# EAGLE board Arche-RoboCore (EAGLE 9.6.2), part 1 of 2
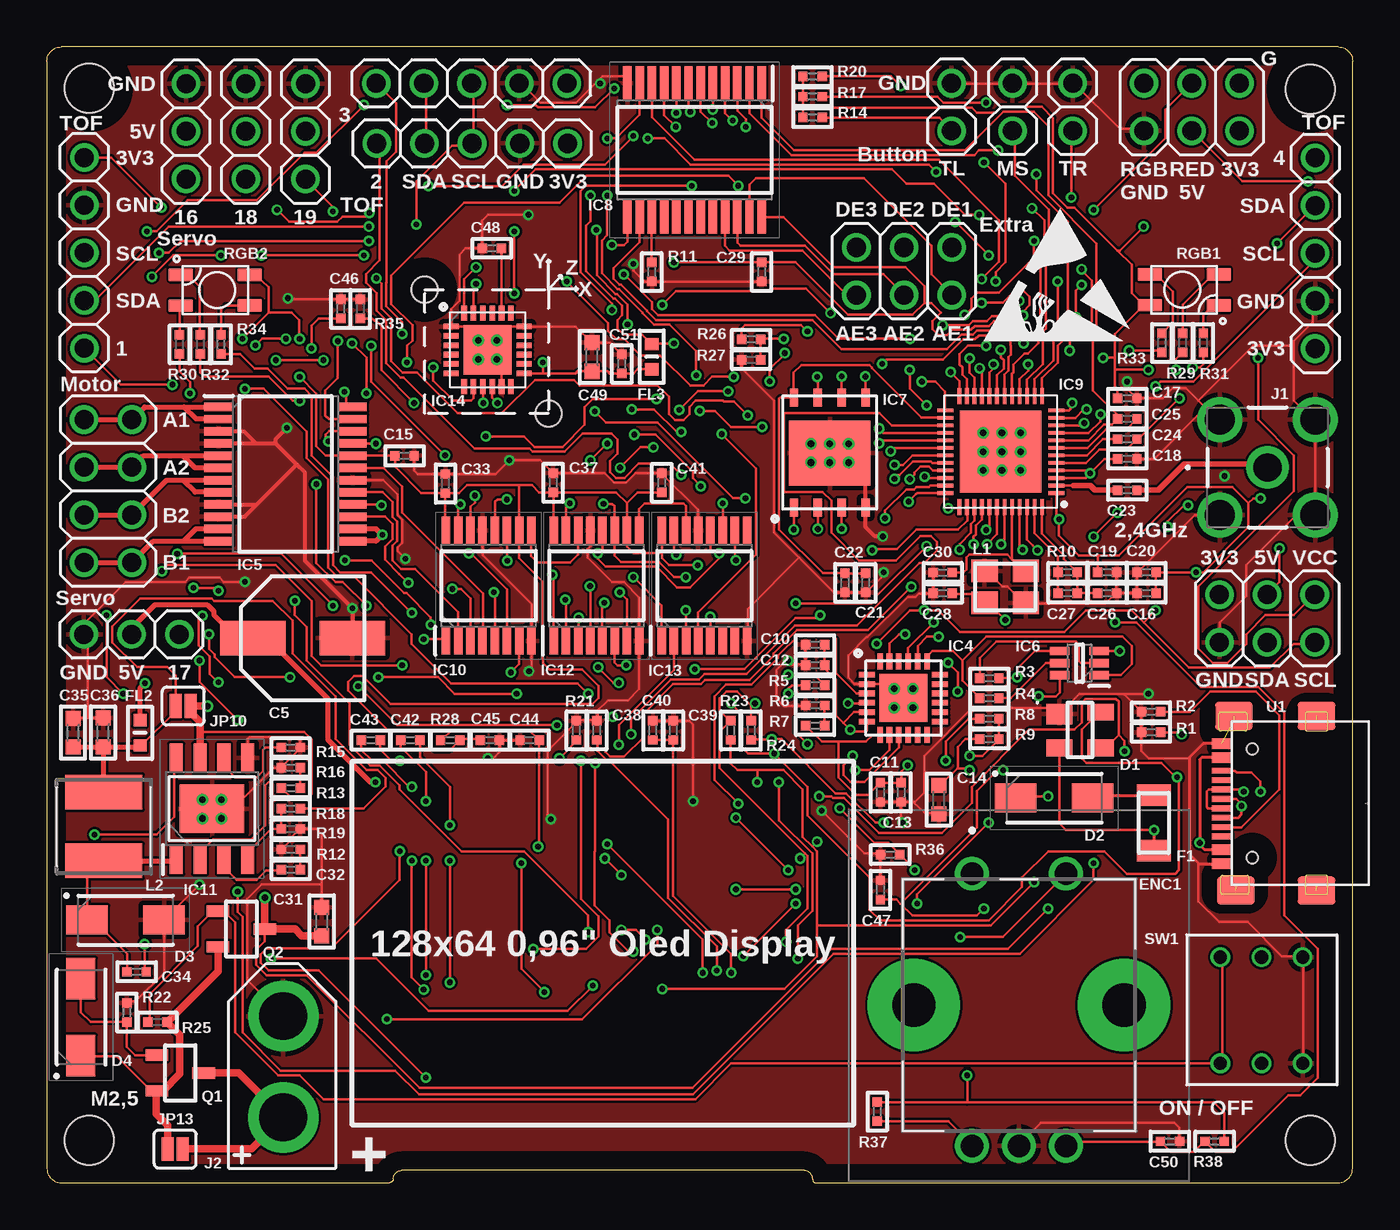
[diagram p2: board, top side]
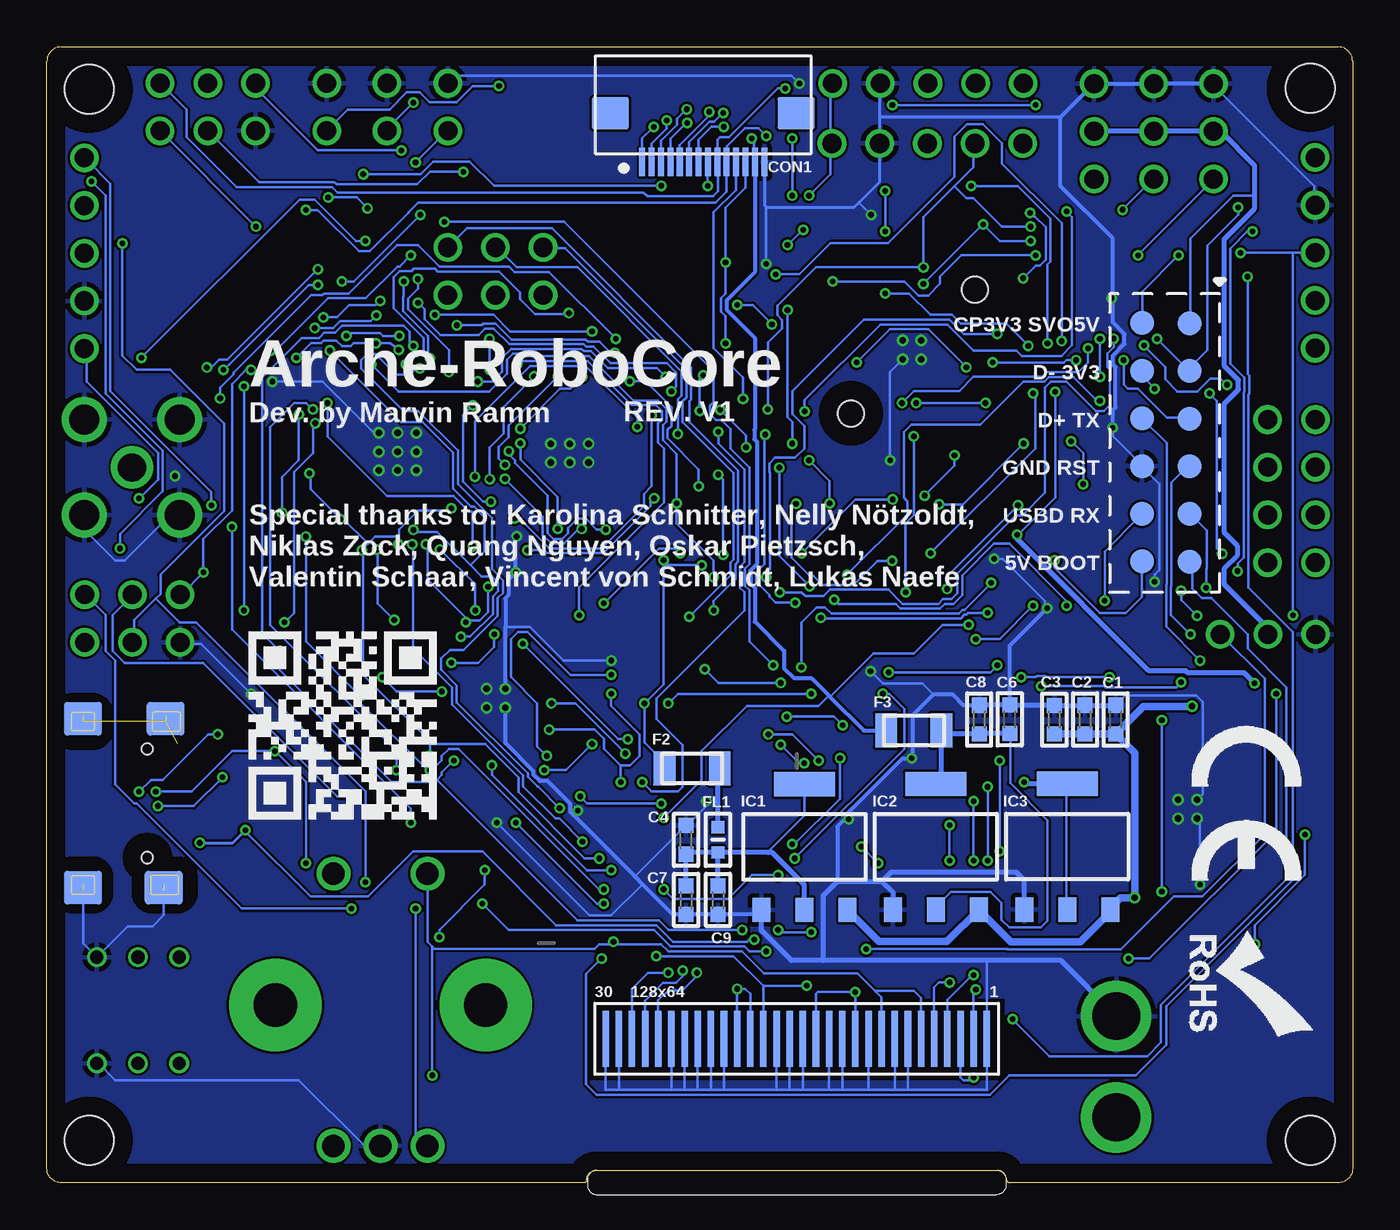
[diagram p3: board, bottom side, seen from below]

Size 69.55 x 60.5 mm. Coordinates in mm from the lower left corner, seen from the top.
Outline: 0.75,0 18.25,0 arc90 18.45,0.2 arc-90 18.9,0.65 40.3,0.65 arc-90 40.8,0.15 arc90 40.9,0 68.8,0 arc90 69.55,0.75 69.55,59.75 arc90 68.8,60.5 0.75,60.5 arc90 0,59.75 0,0.75 arc90 0.75,0
Copper layers (1*16): Top 0.035mm / dielectric 1.53mm / Bottom 0.035mm
Design rules "JLCPCB_1-2layer": minimum track width 5mil, minimum drill 0.3mm, track to track 5mil, track to pad 0.2mm, pad to pad 7mil, via to via 7mil, smd to smd 7mil, copper to edge 40mil, drill to drill 6mil, minimum pad ring 6mil, minimum via ring 0.13mm, stop-mask expansion 0.1mm, vias tented up to drill 20mil, thermal gap 10mil
Holes 2.6 mm at 2.25,2.25 2.25,58.3 67.3,58.25 67.3,2.25
Holes 1.4 mm at 26.72,40.97 20.12,47.57
tRestrict: area 48,36.4 to 53.5,41.6; area 22,42.8 to 25,45.9; area 44.1,24.2 to 47.1,27.2; area 8.9,39.4 to 9.4,40; area 8.9,35.5 to 9.3,36.1
bRestrict: area 18.6,5.4 to 40.6,9.8

## Footprints (pad centres in the part's own frame; a part is rotated, then mirrored left to right if it is on the bottom)
C0603 = smd 0.8 x 0.8: 1 -0.762,0; 2 0.762,0
CAPAE660X800N = smd 3.5 x 1.85: 1 -2.65,0; 2 2.65,0
C0402 = smd 0.5 x 0.5: 1 -0.508,0; 2 0.508,0
FC05-S14FCT-00 = smd 0.32 x 1.5: 1 2.51,-0.45; 2 3.01,-0.45; 3 3.51,-0.45; 4 4.01,-0.45; 5 4.51,-0.45; 6 5.01,-0.45; 7 5.51,-0.45; 8 6.01,-0.45; 9 6.51,-0.45; 10 7.01,-0.45; 11 7.51,-0.45; 12 8.01,-0.45; 13 8.51,-0.45; 14 9.01,-0.45 | smd 2 x 1.7: PAD1 0.81,2.15; PAD2 10.71,2.15
SP0503BAHTG = smd 1.1 x 1.4: 1 -0.85,-1.1 | smd 0.9 x 1.4: 2 0.95,-1.1; 3 0.95,1.1; 4 -0.95,1.1
DIOM5026X262N = smd 2.2 x 1.55: 1 -2.05,0; 2 2.05,0
2864KSWE_128X64I2C = smd 0.35 x 3: D1 0.175,1.5; D2 0.875,1.5; D3 1.575,1.5; D4 2.275,1.5; D5 2.975,1.5; D6 3.675,1.5; D7 4.375,1.5; D8 5.075,1.5; D9 5.775,1.5; D10 6.475,1.5; D11 7.175,1.5; D12 7.875,1.5; D13 8.575,1.5; D14 9.275,1.5; D15 9.975,1.5; D16 10.675,1.5; D17 11.375,1.5; D18 12.075,1.5; D19 12.775,1.5; D20 13.475,1.5; D21 14.175,1.5; D22 14.875,1.5; D23 15.575,1.5; D24 16.275,1.5; D25 16.975,1.5; D26 17.675,1.5; D27 18.375,1.5; D28 19.075,1.5; D29 19.775,1.5; D30 20.475,1.5
PEC12R4230FS0024 = drill 1.2 pad 1.8: 1 0,0; 2 5,0; A1 0,-14.5; B1 5,-14.5; C1 2.5,-14.5 | drill 2.3 pad 4.92: MH1 -3.1,-7; MH2 8.1,-7
FUSC3216X82N = smd 1.16 x 1.81: 1 -1.475,0; 2 1.475,0
BLM18AG102BH1D = smd 0.65 x 0.7: 1 -0.675,0; 2 0.675,0
SOT229P700X180-4N = smd 1.3 x 0.95: 1 -3.35,2.29; 2 -3.35,0; 3 -3.35,-2.29 | smd 1.3 x 3.25: 4 3.35,0
QFN50P400X400X80-25N = smd 0.85 x 0.3: 1 -1.95,1.25; 2 -1.95,0.75; 3 -1.95,0.25; 4 -1.95,-0.25; 5 -1.95,-0.75; 6 -1.95,-1.25; 13 1.95,-1.25; 14 1.95,-0.75; 15 1.95,-0.25; 16 1.95,0.25; 17 1.95,0.75; 18 1.95,1.25 | smd 0.3 x 0.85: 7 -1.25,-1.95; 8 -0.75,-1.95; 9 -0.25,-1.95; 10 0.25,-1.95; 11 0.75,-1.95; 12 1.25,-1.95; 19 1.25,1.95; 20 0.75,1.95; 21 0.25,1.95; 22 -0.25,1.95; 23 -0.75,1.95; 24 -1.25,1.95 | smd 2.55 x 2.55: 25 0,0
SOP65P760X160-24N = smd 1.525 x 0.45: 1 -3.562,3.575; 2 -3.562,2.925; 3 -3.562,2.275; 4 -3.562,1.625; 5 -3.562,0.975; 6 -3.562,0.325; 7 -3.562,-0.325; 8 -3.562,-0.975; 9 -3.562,-1.625; 10 -3.562,-2.275; 11 -3.562,-2.925; 12 -3.562,-3.575; 13 3.562,-3.575; 14 3.562,-2.925; 15 3.562,-2.275; 16 3.562,-1.625; 17 3.562,-0.975; 18 3.562,-0.325; 19 3.562,0.325; 20 3.562,0.975; 21 3.562,1.625; 22 3.562,2.275; 23 3.562,2.925; 24 3.562,3.575
SOT65P230X120-6N = smd 1.05 x 0.45: 1 -1.05,0.65; 2 -1.05,0; 3 -1.05,-0.65; 4 1.05,-0.65; 5 1.05,0; 6 1.05,0.65
SON127P800X600X80-9N = smd 0.95 x 0.45: 1 -2.85,1.905; 2 -2.85,0.635; 3 -2.85,-0.635; 4 -2.85,-1.905; 5 3,-1.905; 6 3,-0.635; 7 3,0.635; 8 3,1.905 | smd 3.45 x 4.35: 9 0.05,0
SOP65P780X200-24N = smd 1.8 x 0.45: 1 -3.55,3.575; 2 -3.55,2.925; 3 -3.55,2.275; 4 -3.55,1.625; 5 -3.55,0.975; 6 -3.55,0.325; 7 -3.55,-0.325; 8 -3.55,-0.975; 9 -3.55,-1.625; 10 -3.55,-2.275; 11 -3.55,-2.925; 12 -3.55,-3.575; 13 3.55,-3.575; 14 3.55,-2.925; 15 3.55,-2.275; 16 3.55,-1.625; 17 3.55,-0.975; 18 3.55,-0.325; 19 3.55,0.325; 20 3.55,0.975; 21 3.55,1.625; 22 3.55,2.275; 23 3.55,2.925; 24 3.55,3.575
QFN40P600X600X90-49N = smd 0.85 x 0.2: 1 -2.95,2.2; 2 -2.95,1.8; 3 -2.95,1.4; 4 -2.95,1; 5 -2.95,0.6; 6 -2.95,0.2; 7 -2.95,-0.2; 8 -2.95,-0.6; 9 -2.95,-1; 10 -2.95,-1.4; 11 -2.95,-1.8; 12 -2.95,-2.2; 25 2.95,-2.2; 26 2.95,-1.8; 27 2.95,-1.4; 28 2.95,-1; 29 2.95,-0.6; 30 2.95,-0.2; 31 2.95,0.2; 32 2.95,0.6; 33 2.95,1; 34 2.95,1.4; 35 2.95,1.8; 36 2.95,2.2 | smd 0.2 x 0.85: 13 -2.2,-2.95; 14 -1.8,-2.95; 15 -1.4,-2.95; 16 -1,-2.95; 17 -0.6,-2.95; 18 -0.2,-2.95; 19 0.2,-2.95; 20 0.6,-2.95; 21 1,-2.95; 22 1.4,-2.95; 23 1.8,-2.95; 24 2.2,-2.95; 37 2.2,2.95; 38 1.8,2.95; 39 1.4,2.95; 40 1,2.95; 41 0.6,2.95; 42 0.2,2.95; 43 -0.2,2.95; 44 -0.6,2.95; 45 -1,2.95; 46 -1.4,2.95; 47 -1.8,2.95; 48 -2.2,2.95 | smd 4.35 x 4.35: 49 0,0
SOP65P640X110-16N = smd 1.475 x 0.45: 1 -2.938,2.275; 2 -2.938,1.625; 3 -2.938,0.975; 4 -2.938,0.325; 5 -2.938,-0.325; 6 -2.938,-0.975; 7 -2.938,-1.625; 8 -2.938,-2.275; 9 2.938,-2.275; 10 2.938,-1.625; 11 2.938,-0.975; 12 2.938,-0.325; 13 2.938,0.325; 14 2.938,0.975; 15 2.938,1.625; 16 2.938,2.275
SOIC127P600X170-9N = smd 1.525 x 0.7: 1 -2.712,1.905; 2 -2.712,0.635; 3 -2.712,-0.635; 4 -2.712,-1.905; 5 2.712,-1.905; 6 2.712,-0.635; 7 2.712,0.635; 8 2.712,1.905 | smd 2.56 x 3.45: 9 0,0
QFN50P400X400X95-25N = smd 0.8 x 0.3: 1 -1.95,1.25; 2 -1.95,0.75; 3 -1.95,0.25; 4 -1.95,-0.25; 5 -1.95,-0.75; 6 -1.95,-1.25; 13 1.95,-1.25; 14 1.95,-0.75; 15 1.95,-0.25; 16 1.95,0.25; 17 1.95,0.75; 18 1.95,1.25 | smd 0.3 x 0.8: 7 -1.25,-1.95; 8 -0.75,-1.95; 9 -0.25,-1.95; 10 0.25,-1.95; 11 0.75,-1.95; 12 1.25,-1.95; 19 1.25,1.95; 20 0.75,1.95; 21 0.25,1.95; 22 -0.25,1.95; 23 -0.75,1.95; 24 -1.25,1.95 | smd 2.55 x 2.65: 25 0,0
518148322 = drill 1.5 pad 2.25: 1 0,0 | drill 1.6 pad 2.4: 2 -2.54,-2.54; 3 2.54,-2.54; 4 2.54,2.54; 5 -2.54,2.54
XT_30 = drill 2.55 pad 3.75: B+ 0,0; GND 5.4,0
2X04 = drill 1.016: 1 -3.81,-1.27; 2 -3.81,1.27; 3 -1.27,-1.27; 4 -1.27,1.27; 5 1.27,-1.27; 6 1.27,1.27; 7 3.81,-1.27; 8 3.81,1.27
1X05 = drill 1.016: 1 -5.08,0; 2 -2.54,0; 3 0,0; 4 2.54,0; 5 5.08,0
1X02 = drill 1.016: 1 -1.27,0; 2 1.27,0
2X03 = drill 1.016: 1 -2.54,-1.27; 2 -2.54,1.27; 3 0,-1.27; 4 0,1.27; 5 2.54,-1.27; 6 2.54,1.27
SMT-JUMPER_2_NO_SILK = smd 0.635 x 1.27: 1 -0.406,0; 2 0.406,0
1X03 = drill 1.016: 1 -2.54,0; 2 0,0; 3 2.54,0
SMD3225_4P16MHZ20PF10PPM4085 = smd 1.4 x 1.2: 1 -1.1,-0.85; 2 1.1,-0.85; 3 1.1,0.85; 4 -1.1,0.85
LQH5BPB100MT0L = smd 1.85 x 4.1: 1 -1.825,0; 2 1.825,0
SOT95P280X125-3N = smd 1.2 x 0.6: 1 -1.25,0.95; 2 -1.25,-0.95; 3 1.25,0
R0402 = smd 0.5 x 0.5: 1 -0.508,0; 2 0.508,0
RGBLED = smd 0.686 x 1.3: +5V -1.456,1.996; P1 0.184,1.996; P2 -1.458,-1.678; P3 0.192,-1.678
XKB7070-Z = drill 0.7: 1_1 1.8,1.15; 1_2 6.18,1.15; 2_1 1.8,6.8; 2_2 6.18,6.8; NC 3.99,1.15; NC2 3.99,6.8
PAD.03X.05 = smd 1.27 x 1.27: 1 0,0
TYPE-C-31-M-14_HRO = smd 0.559 x 1.092: A1B12 -3.11,4; A4B9 -2.36,4; B1A12 3.29,4; B4A9 2.54,4 | smd 0.305 x 1.092: A5 -1.16,4; A6 -0.16,4; A7 0.34,4; A8 1.34,4; B5 1.84,4; B6 0.84,4; B7 -0.66,4; B8 -1.66,4 | smd 1.5 x 2 bottom: P$1 -4.24,3.26; P$2 4.46,3.36; P$3 -4.44,3.26; P$4 4.66,3.36; P$5 -4.24,-1.04; P$6 -4.44,-1.04; P$7 4.46,-1.04; P$8 4.66,-1.04; P$9 -4.54,3.26; P$10 -4.54,-1.04; P$11 4.76,-1.04; P$12 4.76,3.36 | smd 1.5 x 2: P$14 -4.54,3.26; P$16 -4.54,-1.04; P$18 4.76,3.36; P$20 4.76,-1.04 | hole 0.6: -2.79,2.39; 3.01,2.39

## Placement (x,y rotation side)
C1  4,7µF  [C0603]  12.62,24.67 90 bottom
C2  4,7µF  [C0603]  14.25,24.67 90 bottom
C3  4,7µF  [C0603]  15.89,24.66 90 bottom
C4  10µF  [C0603]  35.51,18.26 90 bottom
C5  UUD1C151MCL1GS  [CAPAE660X800N]  13.62,29 0 top
C6  10µF  [C0603]  18.26,24.68 90 bottom
C7  10µF  [C0603]  35.5,15.05 270 bottom
C8  10µF  [C0603]  19.89,24.67 90 bottom
C9  10µF  [C0603]  33.8,15.05 270 bottom
C10  0,1uF  [C0402]  40.92,28.66 0 top
C11  0,1uF  [C0402]  44.4,20.79 90 top
C12  4,7uF  [C0402]  40.92,27.57 0 top
C13  4,7uF  [C0402]  45.5,20.79 90 top
C14  10µF  [C0603]  47.51,20.4 90 top
C15  100nF  [C0402]  19.05,38.72 0 top
C16  100pF  [C0402]  58.57,31.4 0 top
C17  0,1uF  [C0402]  57.55,41.78 180 top
C18  0,1uF  [C0402]  57.55,38.55 180 top
C19  0,1uF  [C0402]  56.48,32.51 180 top
C20  0,1uF  [C0402]  58.57,32.51 0 top
C21  1uF  [C0402]  43.62,31.95 90 top
C22  0,1uF  [C0402]  42.51,31.95 90 top
C23  5,6pF  [C0402]  57.55,36.89 0 top
C24  270pF  [C0402]  57.55,39.61 180 top
C25  270pF  [C0402]  57.55,40.69 0 top
C26  10nF  [C0402]  56.48,31.4 180 top
C27  3nF  [C0402]  54.37,31.4 180 top
C28  12pF  [C0402]  47.72,31.39 0 top
C29  0,1µF  [C0402]  38.07,48.51 270 top
C30  12pF  [C0402]  47.72,32.5 0 top
C31  10µF  [C0603]  14.64,13.91 270 top
C32  100pF  [C0402]  12.99,16.67 180 top
C33  0,1µF  [C0402]  21.23,37.24 90 top
C34  0,1µF  [C0402]  4.78,11.23 180 top
C35  10µF  [C0603]  1.39,23.97 270 top
C36  10µF  [C0603]  2.99,23.98 270 top
C37  0,1µF  [C0402]  26.97,37.28 90 top
C38  1µF  [C0402]  29.3,24.09 270 top
C39  1µF  [C0402]  33.37,24.09 270 top
C40  1µF  [C0402]  32.28,24.09 270 top
C41  0,1µF  [C0402]  32.75,37.28 90 top
C42  1µF  [C0402]  19.36,23.57 0 top
C43  1µF  [C0402]  17.25,23.57 0 top
C44  1µF  [C0402]  25.71,23.57 180 top
C45  1µF  [C0402]  23.6,23.57 0 top
C46  100nF  [C0402]  15.65,46.54 270 top
C47  10nF  [C0402]  44.4,15.59 90 top
C48  10nF  [C0402]  23.7,49.77 180 top
C49  10µF  [C0603]  29.03,43.98 270 top
C50  10nF  [C0402]  59.82,2.2 0 top
C51  1uF  [C0402]  30.62,43.61 90 top
CON1  FC05-S14FCT-00  [FC05-S14FCT-00]  40.35,54.82 0 bottom
D1  SP0503BAHTG  [SP0503BAHTG]  55.03,24.11 270 top
D2  SS34A  [DIOM5026X262N]  53.66,20.49 0 top
D3  SS34A  [DIOM5026X262N]  4.19,13.99 0 top
D4  SS34A  [DIOM5026X262N]  1.81,8.82 90 top
DSP1  2864KSWE_128X64I2C  [2864KSWE_128X64I2C]  39.96,6.16 0 bottom
ENC1  PEC12R-4230F-S0024  [PEC12R4230FS0024]  49.28,16.46 0 top
F1  NANOSMDC020F-2  [FUSC3216X82N]  58.96,19.16 90 top
F2  NANOSMDC020F-2  [FUSC3216X82N]  35.18,22.07 0 bottom
F3  NANOSMDC020F-2  [FUSC3216X82N]  23.37,24.09 0 bottom
FL1  BLM18PG121SN1D  [BLM18AG102BH1D]  33.81,18.26 270 bottom
FL2  BLM18PG121SN1D  [BLM18AG102BH1D]  4.96,23.96 270 top
FL3  BLM18PG121SN1D  [BLM18AG102BH1D]  32.22,44 270 top
IC1  AMS1117-3.3  [SOT229P700X180-4N]  29.2,17.88 90 bottom
IC2  AMS1117-3.3  [SOT229P700X180-4N]  22.2,17.89 90 bottom
IC3  AMS1117-3.3  [SOT229P700X180-4N]  15.2,17.9 90 bottom
IC4  CP2102N-A02-GQFN24R  [QFN50P400X400X80-25N]  45.63,25.81 0 top
IC5  TB6612FNG,C,8,EL  [SOP65P760X160-24N]  12.71,37.75 0 top
IC6  MMDT3904-TP  [SOT65P230X120-6N]  55,27.67 180 top
IC7  W25Q128JVPIQ  [SON127P800X600X80-9N]  41.7,38.82 90 top
IC8  CD74HC4067SM96  [SOP65P780X200-24N]  34.5,55.01 270 top
IC9  ESP32-D0WDQ6  [QFN40P600X600X90-49N]  50.81,38.94 180 top
IC10  74HC595PW,118  [SOP65P640X110-16N]  23.53,31.8 90 top
IC11  MP1584EN-LF-Z  [SOIC127P600X170-9N]  8.79,19.92 90 top
IC12  74HC595PW,118  [SOP65P640X110-16N]  29.27,31.8 90 top
IC13  74HC595PW,118  [SOP65P640X110-16N]  35.02,31.8 90 top
IC14  MPU-6050  [QFN50P400X400X95-25N]  23.47,44.36 0 top
J1  5-1814832-2  [518148322]  65.02,38.1 0 top
J2  XT_30  [XT_30]  12.59,3.47 90 top
JP1  [2X04]  3.25,36.84 270 top
JP2  [1X05]  1.99,49.53 270 top
JP3  [1X02]  48.19,57.3 270 top
JP4  [2X03]  60.98,57.3 0 top
JP5  [1X05]  22.65,55.36 180 top
JP6  [1X02]  51.44,57.3 270 top
JP7  [1X05]  22.62,58.56 180 top
JP8  [1X02]  54.64,57.3 270 top
JP9  [1X05]  67.56,49.51 90 top
JP10  JUMPER-SMT_2_NO_SILK  [SMT-JUMPER_2_NO_SILK]  7.26,25.39 0 top
JP11  [1X03]  10.59,56 90 top
JP12  [1X03]  13.77,56 90 top
JP13  JUMPER-SMT_2_NO_SILK  [SMT-JUMPER_2_NO_SILK]  6.83,1.79 0 top
JP14  [1X03]  4.51,29.21 180 top
JP15  [1X03]  7.41,56 90 top
JP16  [2X03]  45.66,48.55 180 top
JP17  [2X03]  65,30.05 180 top
L1  SMD-3225_4P16MHZ_20PF_10PPM_-4  [SMD3225_4P16MHZ20PF10PPM4085]  51.05,31.74 0 top
L2  LQH5BPB100MT0L  [LQH5BPB100MT0L]  3.03,18.97 90 top
Q1  AO3407A  [SOT95P280X125-3N]  7.1,5.84 0 top
Q2  AO3407A  [SOT95P280X125-3N]  10.36,13.51 0 top
R1  5,1kΩ  [R0402]  58.81,23.99 180 top
R2  5,1kΩ  [R0402]  58.81,25.08 180 top
R3  10kΩ  [R0402]  50.2,26.88 0 top
R4  10kΩ  [R0402]  50.2,25.8 0 top
R5  2,2kΩ  [R0402]  40.92,26.49 0 top
R6  33kΩ  [R0402]  40.92,25.42 180 top
R7  22kΩ  [R0402]  40.92,24.35 0 top
R8  10kΩ  [R0402]  50.2,24.71 180 top
R9  10kΩ  [R0402]  50.2,23.63 0 top
R10  20kΩ  [R0402]  54.37,32.51 0 top
R11  10kΩ  [R0402]  32.22,48.51 270 top
R12  100kΩ  [R0402]  12.99,17.75 180 top
R13  100kΩ  [R0402]  12.99,21.02 180 top
R14  N/C  [R0402]  40.78,56.74 180 top
R15  100kΩ  [R0402]  12.99,23.18 0 top
R16  100kΩ  [R0402]  12.99,22.11 0 top
R17  10kΩ  [R0402]  40.78,57.85 180 top
R18  75kΩ  [R0402]  12.99,19.93 0 top
R19  10kΩ  [R0402]  12.99,18.84 180 top
R20  10kΩ  [R0402]  40.78,58.92 180 top
R21  390kΩ  [R0402]  28.2,24.09 90 top
R22  100kΩ  [R0402]  4.26,9.06 270 top
R23  10kΩ  [R0402]  36.42,24.09 90 top
R24  10kΩ  [R0402]  37.51,24.09 90 top
R25  100kΩ  [R0402]  5.89,8.55 180 top
R26  100kΩ  [R0402]  37.51,44.92 0 top
R27  64,9kΩ  [R0402]  37.51,43.84 180 top
R28  10kΩ  [R0402]  21.48,23.57 0 top
R29  2,2kΩ  [R0402]  60.5,44.73 270 top
R30  2,2kΩ  [R0402]  7.06,44.66 270 top
R31  2,2kΩ  [R0402]  61.6,44.73 270 top
R32  2,2kΩ  [R0402]  8.17,44.66 270 top
R33  2,2kΩ  [R0402]  59.39,44.73 270 top
R34  2,2kΩ  [R0402]  9.28,44.66 270 top
R35  10kΩ  [R0402]  16.69,46.54 270 top
R36  10kΩ  [R0402]  44.92,17.48 0 top
R37  10kΩ  [R0402]  44.23,3.79 270 top
R38  10kΩ  [R0402]  62.2,2.2 180 top
RGB1  RGBLED  [RGBLED]  60.74,48.2 90 top
RGB2  RGBLED  [RGBLED]  8.81,46.91 270 top
SW1  XKB7070-Z  [XKB7070-Z]  60.71,5.21 0 top
TP1  TEST-POINT3X5  [PAD.03X.05]  11.22,33.09 270 bottom
TP3  TEST-POINT3X5  [PAD.03X.05]  11.22,35.63 270 bottom
TP4  TEST-POINT3X5  [PAD.03X.05]  11.22,38.17 270 bottom
TP5  TEST-POINT3X5  [PAD.03X.05]  11.22,40.71 270 bottom
TP6  TEST-POINT3X5  [PAD.03X.05]  11.22,43.25 270 bottom
TP7  TEST-POINT3X5  [PAD.03X.05]  11.22,45.79 270 bottom
TP8  TEST-POINT3X5  [PAD.03X.05]  8.67,33.08 270 bottom
TP9  TEST-POINT3X5  [PAD.03X.05]  8.67,35.62 270 bottom
TP10  TEST-POINT3X5  [PAD.03X.05]  8.67,38.16 270 bottom
TP11  TEST-POINT3X5  [PAD.03X.05]  8.67,40.7 270 bottom
TP12  TEST-POINT3X5  [PAD.03X.05]  8.67,43.24 270 bottom
TP13  TEST-POINT3X5  [PAD.03X.05]  8.67,45.78 270 bottom
U1  TYPE-C-31-M-14  [TYPE-C-31-M-14_HRO]  66.59,20.1 90 top

## Tracks (layer width: path | path; a pad name or v marks a point on that pad's centre or on a via)
0-BOOT  (via drill 0.3)
  Top 0.127: R8.2 49.09,24.71 47.88,23.5 v47.88,22.48 | v57.15,28.32 56.13,28.32 IC6.3 | v18.12,8.7 28.52,8.7 32.51,12.7 v32.51,13.46 | v50.04,44.58 49.06,44.58 48.61,44.13 48.61,43.59 48.77,43.43 48.77,43.05 49.01,42.81 IC9.23
  Bottom 0.127: v47.88,22.48 48.51,21.84 48.51,21.72 48.77,21.46 | 48.77,21.46 48.9,21.34 51.18,21.34 57.15,27.3 v57.15,28.32 58.08,29.25 58.08,42.9 55.99,44.98 55.06,44.98 54.77,45.27 54.2,45.27 53.83,45.64 51.01,45.64 51.01,45.65 50.55,45.65 50.24,45.33 50.24,44.78 v50.04,44.58 | v32.51,13.46 36.45,13.46 36.96,13.97 41.27,13.97 48.77,21.46 | v18.12,8.7 16.14,6.73 10.93,6.73 10.2,7.46 10.2,9.48 3.52,16.16 3.52,26.38 5.59,28.45 5.59,29.2 7.53,31.14 8.03,31.14 8.54,31.66 8.54,32.95 TP8.1
2-T_L  (via drill 0.3)
  Top 0.127: IC9.22 49.41,42.89 49.14,43.16 49.14,43.61 49.16,43.63 v49.16,43.91 | R14.1 47.53,56.73 48.13,56.13 JP3.2 | v50.55,48.01 50.55,48.51 51.05,49.02 51.05,53.21 v49.91,54.36
  Bottom 0.127: v49.91,54.36 48.26,56.01 JP3.2 | v50.55,48.01 50.55,47.23 50.58,47.2 50.58,46.42 49.24,45.09 49.24,43.99 v49.16,43.91
4-S0  (via drill 0.3)
  Top 0.127: IC9.24 48.61,42.7 v48.13,43.18 | IC8.10 32.23,56.75 34.5,54.48 47.51,54.48 50.71,51.28 50.71,49.06 v49.78,48.13
  Bottom 0.127: v49.78,48.13 49.78,47.63 50.32,47.09 50.32,46.53 48.13,44.34 v48.13,43.18
5-S1  (via drill 0.3)
  Top 0.127: IC9.34 46.83,37.54 v46.76,37.61 | v38.1,40.26 36.45,40.26 35.6,41.11 v34.78,41.11 | v29.84,55.63 30.32,55.63 31.58,56.88 IC8.11 | v29.84,52.58 29.84,50.46 29.56,50.17 29.56,48.44 30.4,47.59 30.48,47.59 31.72,46.35 31.72,46.31 32.33,45.7 33.17,45.7 34.59,44.29 v34.59,43
  Bottom 0.127: v34.59,43 34.78,42.81 v34.78,41.11 | v29.84,55.63 v29.84,52.58 | v46.76,37.61 46.74,37.63 46.74,40.57 43.8,43.5 40.85,43.5 38.1,40.75 v38.1,40.26
12-S2
  Top 0.127: IC9.18 51.01,43.05 51.22,43.26 51.22,43.97 51.36,44.12 51.36,44.59 51.32,44.63 51.32,45.33 51.01,45.65 50.55,45.65 50.28,45.37 49.53,45.37 49.33,45.18 48.71,45.18 47.95,44.41 42.33,44.41 40.79,45.95 32.44,45.95 31.97,46.42 31.97,46.45 30.58,47.84 30.51,47.84 30.19,48.16 30.19,48.7 31.58,50.09 IC8.14
13-S3  (via drill 0.3)
  Top 0.127: IC9.20 50.21,43.15 50.41,43.35 v50.41,43.59 v50.42,43.59 | v41.74,46.32 40.44,47.62 38.57,47.62 38.43,47.49 33.51,47.49 v32.77,46.75 | v30.93,45.73 30.93,46.78 30.37,47.34 30.3,47.34 29.3,48.33 29.3,50.72 v29.26,50.76 | v30.1,49.95 30.75,49.95 30.93,50.12 IC8.13
  Bottom 0.127: v50.42,43.59 49.98,44.03 49.81,44.03 49.49,44.35 49.49,44.98 51.09,46.58 51.09,48.23 50.77,48.55 50.14,48.55 50.01,48.68 48.87,48.68 48.73,48.54 45.47,48.54 44.35,47.42 44.35,47.06 43.55,46.26 41.81,46.26 v41.74,46.32 | v32.77,46.75 31.95,46.75 v30.93,45.73 | v29.26,50.76 29.29,50.76 v30.1,49.95
14-T_R  (via drill 0.3)
  Top 0.127: v45.47,58.42 44.95,58.93 41.4,58.93 R20.1 | v52.47,51.91 53.12,51.26 53.12,49.94 52.91,49.73 52.91,45.54 52.8,45.43 52.8,44.72 52.24,44.17 52.07,44.17 51.47,43.56 51.47,43.15 51.41,43.09 IC9.17 | v54.57,52.49 54.57,55.96 JP8.2
  Bottom 0.127: v45.47,58.42 46.86,58.42 47.74,57.54 49.16,57.54 49.69,58.08 50.38,58.08 51.31,57.15 53.52,57.15 JP8.2 | v52.47,51.91 53.05,52.49 v54.57,52.49
15-ENC_SW  (via drill 0.3)
  Top 0.127: IC9.21 49.81,43.26 v49.68,43.39 | v46.23,16.64 46.23,16.68 R36.2 44.82,18.09 44.09,18.09 v42.24,19.94 | v48.64,13.08 50.93,13.08 54.23,16.38 ENC1.2
  Bottom 0.127: v46.23,16.64 46.23,15.88 48.64,13.46 v48.64,13.08 | v42.24,19.94 43.4,21.1 43.41,21.1 43.92,21.61 43.92,21.79 47.72,25.58 47.72,26.49 48.55,27.32 48.55,27.91 48.08,28.38 47.35,28.38 45.54,30.19 45.54,31.13 45.25,31.42 45.25,32.08 45.85,32.67 45.85,35.41 47.65,37.21 47.65,38.99 49.77,41.11 50.55,41.11 52.82,43.37 52.82,43.82 52.5,44.14 52.05,44.14 50.95,43.05 50.19,43.05 49.85,43.39 v49.68,43.39
16-SERVO4  (via drill 0.3)
  Top 0.127: v46.61,42.67 47.32,42.67 47.84,42.15 47.84,41.14 IC9.25 | v36.58,42.93 35.43,42.93 34.96,42.46 34.27,42.46 32.66,44.07 31.62,44.07 30.76,44.93 30.34,44.93 29.9,45.37 29.9,45.79 v27.69,48.01 | v11.43,49.4 v16.89,49.4
  Bottom 0.127: v27.69,48.01 23.88,48.01 23.11,47.24 22.61,47.24 21.97,47.88 21.97,48.26 20.83,49.4 v16.89,49.4 | v11.43,49.4 7.49,53.34 JP15.1 | v36.58,42.93 37.04,43.39 39.67,43.39 40.56,44.29 40.95,44.29 41.07,44.41 44.83,44.41 45.3,43.94 45.3,43.2 45.82,42.67 v46.61,42.67
17-SERVO3  (via drill 0.3)
  Top 0.127: v28.45,22.48 28.45,15.11 29.37,14.19 29.37,13.11 28.71,12.45 v25.91,12.45 | IC9.27 45,40.34 44.35,40.99 39.35,40.99 39.26,40.9 39.26,36.82 39.28,36.8 41.31,36.8 41.78,36.33 41.78,34.63 43.26,33.15 45.21,33.15 46.52,34.45 47.09,34.45 47.41,34.13 47.41,33.68 46.74,33.02 46.48,33.02 43.14,29.68 39.84,29.68 37.26,27.1 35.02,27.1 34.73,26.81 33.26,26.81 31.11,24.66 v31.11,23.88
  Bottom 0.127: v31.11,23.88 29.84,23.88 v28.45,22.48 | v25.91,12.45 18.41,12.45 18.39,12.43 12.34,12.43 9.53,15.24 7.99,15.24 4.69,18.55 4.69,26.85 JP14.1
18-SERVO2  (via drill 0.3)
  Top 0.127: IC9.35 47.06,37.14 46.98,37.07 46.33,37.07 46.19,36.93 45.78,36.93 44.64,35.79 v44.64,35.39 | v17.54,48.18 17.82,47.9 17.82,46.55 18.32,46.05 18.32,43.77 18.95,43.15 19.71,43.15 21.88,40.99 24.23,40.99 25.99,42.75 28.09,42.75 28.37,42.47 32.53,42.47 33.14,41.86 33.14,40.94 33.45,40.62 33.91,40.62 34.22,40.94 34.22,41.32 34.55,41.65 36.02,41.65 36.05,41.62 36.59,41.62 v37.34,40.87 | v17.18,51.66 16.99,51.47 15.75,51.47 15.47,51.19 12.9,51.19 v12.26,51.83
  Bottom 0.127: v44.64,35.39 44.5,35.25 44.24,35.25 42.78,33.79 40.01,33.79 37.75,36.05 37.75,36.68 37.34,37.1 v37.34,40.87 | v17.54,48.18 16.86,48.86 16.67,48.86 16.35,49.18 16.35,50.9 16.92,51.47 16.99,51.47 v17.18,51.66 | v12.26,51.83 10.63,53.46 JP11.1
19-SERVO1  (via drill 0.3)
  Top 0.127: v43.97,33.69 43.97,33.76 45.28,33.76 46.31,34.8 48.54,34.8 49.02,35.28 49.02,35.94 IC9.38 | v37.21,36.46 36.54,36.46 32.51,40.48 29.79,40.48 v29.19,41.08 | v15.24,51.73 15.24,51.97 13.82,53.39 13.79,53.44 JP12.1
  Bottom 0.127: v37.21,36.46 37.41,36.26 37.41,36.03 39.91,33.53 42.9,33.53 43.06,33.69 v43.97,33.69 | v15.24,51.73 14.95,51.44 14.95,44.61 15.52,44.03 17.62,44.03 17.91,44.32 20.19,44.32 21.59,45.72 25.15,45.72 29.19,41.68 v29.19,41.08
21-SDA  (via drill 0.3)
  Top 0.127: v50.1,34 50.1,34.03 50.61,34.54 IC9.42 | v22.86,48.77 22.23,48.13 22.23,46.35 IC14.24 | JP2.4 2.54,46.99 6.48,50.93 v17.14,50.93 | JP7.4 20.19,58.55 20.19,55.37 JP5.4 | v65.53,50.04 67.44,51.94 JP9.4 | 37.85,21.97 39.24,21.97 40.26,20.95 40.26,18.41 40.77,17.91 | 37.85,21.97 36.79,21.97 36.42,22.34 R23.1 | 40.77,17.91 41.02,17.65 41.02,13.72 | 41.02,13.72 41.02,12.06 39.28,10.32 v32.77,10.32 | 40.77,17.91 v41.02,18.16 | v52.58,16 50.29,13.72 41.02,13.72 | v31.15,41.19 32.34,41.19 33.53,40.01 v33.78,40.01 | 37.85,21.97 v37.85,21.34
  Bottom 0.127: 21.21,53.09 20.19,54.1 20.19,55.24 JP5.4 | 21.21,53.09 22.86,51.44 v22.86,48.77 28.58,48.77 30.64,46.71 30.64,46.21 30.39,45.95 30.39,45.51 31.15,44.74 v31.15,41.19 | v17.14,50.93 18.67,50.93 20.19,52.45 20.57,52.45 21.21,53.09 | 63.75,31.11 63.5,31.37 63.5,32.38 60.11,35.77 60.11,40.42 62.99,43.31 64.77,43.31 65.53,44.07 v65.53,50.04 | 63.75,31.11 64.9,29.97 64.9,28.83 JP17.4 | 63.75,31.11 62.48,29.84 61.59,29.84 52.58,20.83 v52.58,16 | v33.78,40.01 33.78,39.37 32.38,37.97 32.38,33.06 32.62,32.83 32.62,31.69 32.38,31.45 32.38,30.48 37.08,25.78 37.08,24.7 35.69,23.31 35.69,21.08 35.94,20.83 37.34,20.83 v37.85,21.34 | v50.1,34 50.04,33.94 50.04,28.45 47.97,26.39 47.97,25.48 44.18,21.68 44.18,21.11 42.47,19.4 42.26,19.4 v41.02,18.16 | DSP1.D11 32.78,10.31 v32.77,10.32 32.36,10.32 32.09,10.05 DSP1.D12
22-SCL  (via drill 0.3)
  Top 0.127: IC9.39 49.41,35.27 49.23,35.1 49.23,34.64 48.62,34.03 v48.62,33.72 | v22.86,47.88 22.73,47.75 22.73,46.35 IC14.23 | v19.68,51.05 19.68,53.34 21.59,55.24 22.61,55.24 JP5.3 22.73,55.37 22.73,58.55 JP7.3 | v5.97,49.53 6.48,49.53 7.11,50.16 v17.14,50.16 | v44.2,28.7 45.97,30.48 v46.74,30.48 47.5,30.48 48.64,29.34 54.2,29.34 55.35,30.48 57.78,30.48 58.42,29.84 | R24.1 37.55,23.6 38.59,23.6 v38.61,23.62 39.12,23.62 42,20.74 42.57,20.74 44.13,19.18 v44.58,19.18 | v39.88,14.86 v37.08,12.06 | 58.42,29.84 60.83,27.43 65.15,27.43 66.42,28.7 67.44,28.7 JP17.2 | v59.05,42.42 59.31,42.67 61.06,42.67 67.44,49.05 67.44,49.4 JP9.3 | 58.42,29.84 v59.05,30.48 | v3.17,30.23 3.17,26.92 v4.06,26.04 | v11.94,11.94 17.53,11.94 20.32,9.14 27.74,9.14 v29.08,10.49
  Bottom 0.127: v22.86,47.88 v19.68,51.05 18.8,50.16 v17.14,50.16 | v5.97,49.53 3.17,49.53 | 3.17,49.53 JP2.3 | v38.61,23.62 39.12,23.62 v44.2,28.7 | v46.74,30.48 46.74,31.88 48.51,33.66 v48.62,33.72 | v39.88,14.86 40.26,14.86 v44.58,19.18 | v59.05,30.48 v59.05,42.42 | v3.17,30.23 3.17,49.53 | v11.94,11.94 10.82,11.94 4.06,18.69 v4.06,26.04 | DSP1.D13 31.39,10.46 31.36,10.49 | v29.08,10.49 31.36,10.49 | 31.36,10.49 31.39,10.49 32.97,12.06 v37.08,12.06
23-PWMA  (via drill 0.3)
  Top 0.127: IC9.36 46.36,36.74 46.3,36.68 v45.9,36.28 | v46.86,41.4 45.96,42.3 v45.96,43.3 | v45.97,44.96 42.16,44.96 40.92,46.21 32.55,46.21 32.23,46.52 32.23,46.9 v30.73,48.39 | v15.49,44.83 15.49,42.86 14.83,42.2 14.83,40.87 15.03,40.68 IC5.23
  Bottom 0.127: v45.9,36.28 46.31,36.28 47.37,37.34 47.37,40.89 v46.86,41.4 | v45.97,44.96 45.96,44.95 v45.96,43.3 | v30.73,48.39 29.46,48.39 27.81,50.04 24.76,50.04 21.21,53.59 21.21,55.71 20.54,56.39 19.68,56.39 18.67,55.37 18.67,54.28 15.49,51.11 v15.49,44.83
25-PWMB  (via drill 0.3)
  Top 0.127: IC5.15 18.01,35.48 18.4,35.09 18.4,34.28 18.01,33.89 18.01,33.19 18.76,32.43 18.77,32.43 v19.25,31.95 | v29.36,27.45 30.19,26.62 v30.47,26.62 | v41.2,30.23 41.05,30.08 39.88,30.08 37.15,27.35 v34.5,27.35 | v44.5,43.61 44.73,43.84 47.73,43.84 48.81,44.92 49.44,44.92 49.63,45.12 50.26,45.12 50.28,45.1 v50.78,45.1 | v53.6,45.1 53.6,43.8 52.61,42.81 IC9.14
  Bottom 0.127: v19.25,31.95 20.68,30.52 20.78,30.52 20.98,30.32 27.77,30.32 28.1,30.64 28.55,30.64 29.36,29.83 v29.36,27.45 | v30.47,26.62 33.78,26.62 34.5,27.34 v34.5,27.35 | v44.5,43.61 44.35,43.76 40.75,43.76 38.41,41.41 37.12,41.41 36.8,41.09 36.8,40.65 36.99,40.45 36.99,39.42 36.67,39.1 36.67,36.23 41.2,31.7 v41.2,30.23 | v50.78,45.1 51.65,45.1 51.8,45.25 53.45,45.25 v53.6,45.1
26-METAL_S  (via drill 0.3)
  Top 0.127: IC9.15 52.21,42.77 53.06,43.61 53.06,45.33 53.21,45.48 53.21,49.67 53.38,49.84 53.38,51.84 51.56,53.65 51.56,55.91 JP6.2 | v50.04,57.53 47.75,57.53 47.44,57.84 41.41,57.84 41.4,57.85 R17.1
  Bottom 0.127: v50.04,57.53 51.44,56.13 JP6.2
27-SHCP  (via drill 0.3)
  Top 0.127: IC9.16 51.81,42.8 52.27,43.26 v52.27,43.6 | v24.52,33.12 24.52,34.56 IC10.11 | v29.65,36.16 30.11,36.16 30.23,36.04 30.23,34.8 IC12.11 30.24,33.41 30.59,33.07 32.59,33.07 33.4,32.26 v34.04,32.26 | v36.01,36.19 v36.02,36.18 36.02,34.76 IC13.11
  Bottom 0.127: v24.52,33.12 25.3,33.12 26.58,31.84 28.22,31.84 28.7,32.32 28.9,32.32 29.88,33.3 29.88,35.93 v29.65,36.16 | v34.04,32.26 34.04,33.15 36.01,35.12 v36.01,36.19 36.01,38.82 36.74,39.55 36.74,40.34 36.54,40.54 36.54,41.2 37.01,41.67 38.3,41.67 40.67,44.03 44.16,44.03 44.27,44.15 44.73,44.15 45.04,43.84 45.04,43.09 46.01,42.13 50.8,42.13 v52.27,43.6
32-STCP  (via drill 0.3)
  Top 0.127: v24.5,36.39 24,36.39 23.88,36.27 23.88,34.8 IC10.12 | 29.59,34.67 IC12.12 29.59,34.06 | IC9.12 54.44,41.14 54.61,41.31 v54.61,41.53 | v46.86,33.91 44.2,31.24 44.2,31.14 43.91,30.86 v39.88,30.86 | IC13.12 35.35,33.76 35.58,33.53 v35.81,33.53 35.81,33.27 34.26,31.71 33.56,31.71 32.47,32.81 29.76,32.81 29.34,33.24 v29.34,33.53 29.59,33.78 29.59,34.06 | 29.59,34.04 29.59,34.06
  Bottom 0.127: v24.5,36.39 26.47,36.39 v29.34,33.53 | v54.61,41.53 54.61,39.75 51.44,36.58 47.88,36.58 47.06,35.76 46.93,35.76 46.86,35.69 v46.86,33.91 | v39.88,30.86 36.96,33.78 36.07,33.78 v35.81,33.53
33-DS  (via drill 0.3)
  Top 0.127: v49.66,51.56 48.9,51.56 47.24,53.21 45.77,53.21 45.01,53.98 26.04,53.98 v24.89,52.83 | v24.89,47.37 v24.89,50.67 | v17.27,44.58 17.27,42.67 v21.21,38.73 | v22.8,36.6 22.8,36.24 22.58,36.01 22.58,34.76 IC10.14 | v53.85,48.01 53.85,45.62 54.14,45.33 54.14,44.88 53.85,44.59 53.85,43.69 53.01,42.85 IC9.13
  Bottom 0.127: v53.85,48.01 53.21,48.01 v49.66,51.56 | v24.89,50.67 v24.89,52.83 | v24.89,47.37 23.62,47.37 22.48,46.23 21.34,46.23 20.86,45.76 18.45,45.76 v17.27,44.58 | v21.21,38.73 21.21,38.19 v22.8,36.6
34-ENC_B  (via drill 0.3)
  Top 0.127: IC9.10 55.14,40.34 v55.26,40.46 | v56.9,29.84 58.04,29.84 61.47,26.42 64.52,26.42 65.91,25.02 65.91,14.22 67.69,12.45 67.69,5.58 66.76,4.65 66.12,4.65 63.12,1.65 62.23,1.65 61.72,2.16 R38.2 61.59,2.16 61.09,1.65 59.86,1.65 C50.1 59.31,2.16 54.49,2.16 ENC1.B1
  Bottom 0.127: v56.9,29.84 56.39,30.35 56.39,37.85 55.37,38.86 55.37,40.39 v55.26,40.46
35-ENC_A  (via drill 0.3)
  Top 0.127: IC9.11 54.77,40.74 55.23,41.2 v55.39,41.2 | R37.2 44.34,3.28 44.33,3.27 48.03,3.27 49.28,2.03 ENC1.A1 | C47.1 45.24,15.09 45.47,14.86 | 45.47,14.86 46.1,14.22 49.53,14.22 v49.91,14.61 | v50.93,21.97 50.9,21.94 50.6,21.94 49.53,20.87 49.53,18.92 45.47,14.86
  Bottom 0.127: v49.91,14.61 49.91,2.54 49.4,2.03 ENC1.A1 | v50.93,21.97 50.93,22.99 57.66,29.72 57.66,40.26 56.39,41.53 55.75,41.53 55.5,41.27 v55.39,41.2
36-VBAT  (via drill 0.3)
  Top 0.127: IC9.5 55.35,38.34 56.07,39.06 57.51,39.06 C24.1 58.17,39.62 v60.33,41.78 | R27.1 R26.2 38.1,44.96 v39.24,44.96
  Bottom 0.127: v39.24,44.96 42.8,48.51 44.65,48.51 44.92,48.79 48.62,48.79 49.78,49.95 50.89,49.95 53.47,47.37 54.79,47.37 54.88,47.28 55.47,47.28 59.6,43.15 59.6,43.08 60.33,42.35 v60.33,41.78
39-VOUT
  Top 0.127: IC9.8 55.47,39.54 56.31,40.38 56.73,40.38 C25.1 57.04,40.88 55.72,42.2 55.72,45.19 55.91,45.38 55.91,50.02 53.34,52.59 53.34,56.28 52.56,57.06 50.96,57.06 48.91,55.01 39.8,55.01 38.07,56.73 IC8.1
+3V3  (via drill 0.3)
  Top 0.127: IC9.4 55.42,37.94 v55.58,37.78 | IC9.3 55.33,37.54 v55.58,37.78 | IC9.1 53.76,35.48 v53.91,35.34 53.91,34.46 54.97,33.4 55.99,33.4 | IC9.46 52.21,34.26 52.53,33.94 52.53,33.93 v52.76,33.69 | IC9.43 51.01,34.17 v50.83,34 | IC9.37 48.55,35.93 v48,35.93 | v55.58,37.78 55.58,37.79 56.33,38.55 C18.2 | R8.1 R9.2 50.71,23.62 49.82,22.73 v49.15,22.73 | C16.2 C20.2 59.18,32.51 v61.21,32.51 61.59,32.51 64.01,34.92 64.01,36.2 | 55.99,33.4 55.99,32.53 C19.2 | 64.01,36.2 63.14,37.06 60.75,37.06 57.09,33.4 55.99,33.4 | v64.64,36.45 64.26,36.45 64.01,36.2 | 46.74,46.86 46.1,46.23 42.67,46.23 39.87,49.03 38.09,49.03 C29.1 37.97,49.02 v33.4,49.02 | 46.74,46.86 46.74,47.75 45.72,48.77 41.91,48.77 39.24,51.44 38.1,51.44 IC8.24 | v33.4,44.7 32.26,44.7 FL3.1 31.71,45.19 30.7,45.19 30.39,45.51 30.39,45.95 30.64,46.21 30.64,46.71 30.27,47.08 30.19,47.08 28.72,48.56 28.72,50.98 28.96,51.23 v28.96,52.58 | 40.28,57.26 R17.2 R20.2 | 40.28,57.26 R14.2 | 56.9,43.94 56.9,45.19 58.41,46.71 RGB1.+5V 58.42,46.74 57.78,47.38 57.78,48.9 57.02,49.66 | 56.9,43.94 56.9,43.31 | 56.9,43.31 56.9,42.42 57.02,42.29 57.02,41.78 C17.2 | 40.28,57.26 49.26,57.26 49.53,56.99 50.51,56.99 50.83,57.31 53,57.31 53.59,56.72 53.59,52.7 54.34,51.95 54.73,51.95 57.02,49.66 | 56.9,43.94 v56.26,43.94 | v58.42,50.93 57.15,49.66 57.02,49.66 | 46.74,46.86 47.12,46.86 47.62,46.36 47.17,45.91 47.17,45.45 47.48,45.14 47.94,45.14 48.23,45.43 49.23,45.43 49.42,45.63 50.18,45.63 50.45,45.9 51.11,45.9 51.58,45.43 51.58,45.15 v52.02,44.71 | 56.9,43.31 v58.67,43.31 | 49.01,4.27 62.17,4.27 62.71,3.73 R38.1 | R37.1 44.29,4.24 44.32,4.27 49.02,4.27 v49.02,5.71
  Top 0.127: 11.81,46.35 v10.41,44.96 | 11.81,46.35 11.81,47.7 11.08,48.37 RGB2.+5V | JP2.1 3.43,54.61 v6.1,51.94 | 37.52,25.41 36.76,26.16 36.2,26.16 35.81,25.78 35.81,25.15 36.32,24.64 R23.2 36.32,24.51 35.81,24 35.81,22.1 40.39,17.53 | R24.2 37.52,25.4 37.59,25.4 v37.72,25.53 | v36.7,33.15 36.65,33.2 36.65,34.73 IC13.10 | C33.1 21.22,36.72 21.22,34.78 IC10.16 | C33.1 19.94,36.74 18.54,38.14 C15.1 18.54,38.73 16.38,38.73 IC5.20 16.26,38.73 14.86,38.73 14.35,39.24 14.35,42.04 v13.46,42.93 | 32.64,34.67 IC13.16 32.76,34.72 32.76,33.53 | 30.99,34.67 IC12.10 | IC12.16 26.99,36.75 C37.1 | C45.1 22.99,23.62 22.1,23.62 R28.2 21.47,23.06 20.61,23.06 20.45,23.22 20.45,23.86 20.2,24.12 18.14,24.12 16.04,26.23 16.04,26.68 16.36,26.99 16.8,26.99 18.31,25.49 29.05,25.49 29.37,25.81 29.37,26.47 28.51,27.33 26.77,27.33 26.42,27.69 26.42,32 25.16,33.27 IC10.10 | 25.27,34.8 IC10.10 | C37.1 | C33.1 | v34.67,32.89 33.15,32.89 32.76,33.28 32.76,33.53 | v39.37,12.83 39.37,13.46 40.51,14.61 40.51,17.4 40.39,17.53 | 40.39,17.53 v40.13,17.27 | IC9.19 50.61,43.01 50.96,43.37 50.96,43.81 50.82,43.96 v50.82,44.37 | v13.46,44.96 13.45,44.97 13.45,45.95 13.05,46.35 11.81,46.35 | 32.68,36.7 C41.1 31.46,36.77 30.89,36.2 | C33.1 21.95,36.73 22.38,37.16 25.14,37.16 | C37.1 26.23,36.77 25.84,37.16 25.14,37.16 | IC10.10 25.16,37.15 25.14,37.16 | IC12.10 30.89,33.88 31.24,33.53 32.76,33.53 | IC12.10 30.89,36.2 | C37.1 30.33,36.77 30.89,36.2
  Bottom 0.127: 50.8,34.42 50.8,34.04 v50.83,34 | 50.8,34.42 50.8,34.8 49.78,35.81 48.01,35.81 v48,35.93 | 49.15,23.37 49.15,23.5 52.7,27.05 52.7,33.66 v52.76,33.69 52.7,33.78 52.45,34.04 | 49.15,23.37 v49.15,22.73 | 50.8,34.42 52.07,34.42 52.45,34.04 | v55.58,37.78 55.5,37.72 55.5,36.96 53.98,35.43 v53.91,35.34 53.85,35.43 52.45,34.04 | JP17.5 62.36,31.37 v61.21,32.51 61.21,34.29 59.69,35.81 59.69,42.55 58.94,43.31 v58.67,43.31 | v64.64,36.45 63.63,37.47 63.63,38.86 67.44,42.67 67.44,44.32 JP9.1 | JP7.1 27.81,58.55 27.81,55.37 JP5.1 27.81,55.24 27.81,53.72 v28.96,52.58 | CON1.12 32.34,53 33.4,51.94 v33.4,49.02 33.4,47.35 33.64,47.11 33.64,46.39 33.4,46.15 v33.4,44.7 | v50.82,44.37 51.27,44.71 v52.02,44.71 53.22,44.71 53.38,44.56 53.83,44.56 54.14,44.87 54.82,44.87 54.96,44.73 55.48,44.73 v56.26,43.94 | v58.42,50.93 63.5,56.01 JP4.5 | DSP1.D22 25.09,9.87 25.42,10.19 | DSP1.D25 22.99,7.75 22.99,9.85 23.36,10.21 25.39,10.21 25.42,10.19 | 49.02,12.57 48.9,12.45 40.39,12.45 40.13,12.7 39.37,12.7 | 49.02,12.57 49.28,12.83 49.28,16.38 ENC1.1 | 39.37,12.7 36.83,12.7 36.45,12.32 32.51,12.32 31.34,11.15 26.37,11.15 25.42,10.19 | 49.02,12.57 v49.02,5.71 | v10.41,44.96 8.78,43.32 | 8.78,43.32 8.76,43.31 TP12.1 | v6.1,51.94 6.1,51.56 7.75,49.91 7.75,44.35 8.78,43.32 | F2.1 36.66,22.38 37.72,23.44 v37.72,25.53 36.7,26.54 36.7,32.89 | v34.67,32.89 36.7,32.89 | 36.7,32.89 v36.7,33.15 | v13.46,42.93 v13.46,44.96 | v39.37,12.83 39.37,12.7 | v40.13,17.27 40.9,17.27 44.43,20.8 44.43,21.58 46.22,23.37 49.15,23.37
+5V  (via drill 0.3)
  Top 0.127: 42.16,23.5 43.64,23.5 44,23.86 IC4.7 | 42.16,23.5 41.27,23.5 40.51,24.26 R7.1 | 42.16,23.5 42.16,21.59 43.1,20.65 43.72,20.65 44.28,21.21 44.32,21.21 C11.2 C13.2 45.52,21.31 45.52,21.9 v45.85,22.23 | v36.7,19.43 v39.5,16.64 | v53.34,20.57 51.69,20.57 D2.1 | v65.66,33.78 65.66,32 65.02,31.37 JP17.3 | v32,55.63 32.89,55.63 34.29,54.23 46.99,54.23 v47.37,53.85 | v20.45,29.72 20.45,30.11 19.15,31.41 19.02,31.41 17.28,33.15 v15.88,33.15 | v67.18,53.34 63.67,53.34 JP4.3
  Bottom 0.127: TP1.1 11.21,31.2 12.06,30.35 13.46,30.35 15.88,32.77 v15.88,33.15 | v20.45,29.72 21.84,29.72 23.37,28.19 25.53,28.19 27.84,25.88 | v45.85,22.23 45.85,21.72 40.77,16.64 v39.5,16.64 | v36.7,19.43 34.67,21.46 34.67,22.99 32.26,25.4 28.45,25.4 27.9,25.94 | v53.34,20.57 54.1,20.57 61.21,27.69 65.41,27.69 66.04,28.32 66.04,30.23 65.02,31.24 JP17.3 | v67.18,53.34 66.42,52.58 66.42,42.04 63.37,38.99 63.37,36.83 65.66,34.54 v65.66,33.78 | v32,55.63 31.88,55.5 31.88,54.48 CON1.13 | v47.37,53.85 49.15,53.85 49.82,53.18 54.13,53.18 54.24,53.29 58.24,53.29 JP4.3
  Bottom 0.2: F3.1 26.04,24.08 27.84,25.88 27.9,25.94 28.83,26.87 29.75,26.87 30.28,27.4 30.28,28.32 31.84,29.88 31.84,31.68 32.08,31.91 32.08,32.6 31.73,32.95 31.73,39.47 31.87,39.61 31.87,40.09 31.84,40.12 31.84,45 33.35,46.51 33.35,46.99 31.84,48.5 CON1.13
A1
  Top 0.254: JP1.1 JP1.2 5.2,41.33 7.29,41.33 | 7.29,41.33 IC5.1 | IC5.2 7.94,40.67 7.29,41.33
A2
  Top 0.254: JP1.3 JP1.4 5.13,38.73 7.24,38.73 | 7.24,38.73 IC5.5 | IC5.6 7.89,38.08 7.24,38.73
AE1
  Top 0.127: IC8.23 37.42,53.16 37.77,53.51 43.52,53.51 47.12,49.91 47.12,48.39 48.13,47.37 JP16.2
AE2
  Top 0.127: IC8.22 36.78,50.07 36.94,49.91 40.39,49.91 41.91,48.39 44.55,48.39 JP16.4
AE3
  Top 0.127: JP16.6 43.03,47.37 42.55,47.37 40.26,49.66 36.37,49.66 36.12,49.9 IC8.21
AIN1  (via drill 0.3)
  Top 0.127: IC10.15 21.9,36.01 v22.02,36.13 | v17.53,39.37 16.38,39.37 IC5.21
  Bottom 0.127: v22.02,36.13 20.77,36.13 v17.53,39.37
AIN2  (via drill 0.3)
  Top 0.127: v20.07,28.96 21.21,28.96 IC10.1 | v17.02,30.73 15.75,32 15.37,32 14.35,33.02 v14.35,37.21 | v14.99,39.5 14.86,39.63 14.86,39.84 15.04,40.02 IC5.22
  Bottom 0.127: v20.07,28.96 18.8,28.96 v17.02,30.73 | v14.35,37.21 14.35,38.86 v14.99,39.5
B1
  Top 0.254: JP1.7 JP1.8 5.67,34.17 7.28,34.17 | 7.28,34.17 IC5.12 | IC5.11 7.93,34.83 7.28,34.17
B2
  Top 0.254: JP1.5 JP1.6 6.38,37.42 7.24,37.42 | 7.24,37.42 IC5.7 | IC5.8 7.89,36.77 7.24,37.42
BIN1
  Top 0.127: IC10.2 21.89,28.87 21.89,30.41 19.61,32.69 18.87,32.69 18.41,33.14 18.41,33.94 18.66,34.18 18.66,35.21 18.41,35.45 18.41,36.26 17.89,36.78 16.28,36.78 IC5.17
BIN2  (via drill 0.3)
  Top 0.127: v21.59,31.62 22.05,31.62 22.56,31.11 IC10.3 | v17.83,36.08 17.79,36.12 16.29,36.12 IC5.16
  Bottom 0.127: v21.59,31.62 21.59,32.31 v17.83,36.08
CP3V3  (via drill 0.3)
  Top 0.127: C10.2 C12.2 41.45,27.57 41.45,27.36 42.04,26.77 42.04,24.89 42.43,24.5 | R5.1 39.68,26.5 39.5,26.32 v39.5,26.04 | IC4.6 43.68,24.09 43.62,24.03 42.9,24.03 v42.8,24.13 42.43,24.5 | v9.27,49.4 6.73,49.4 v5.59,48.26 | v40.01,11.94 40.01,13.72 40.77,14.48 40.77,17.53 38.99,19.3 v38.99,21.34 | IC4.5 42.99,25.06 42.43,24.5
  Bottom 0.127: v39.5,26.04 39.5,25.4 37.97,23.88 37.97,22.73 38.48,22.23 38.99,22.23 | 38.99,22.23 39.88,23.11 39.88,23.62 40.39,24.13 v42.8,24.13 | v9.27,49.4 11.21,47.47 11.21,45.81 TP7.1 | 38.99,22.23 v38.99,21.34 | v5.59,48.26 5.59,43.08 5.51,43 5.51,42.02 5.54,41.99 5.54,31.71 3.17,29.34 3.17,16.13 9.92,9.38 9.92,7.34 11.54,5.71 18.29,5.71 19.32,4.69 40.28,4.69 40.82,5.23 40.82,11.12 v40.01,11.94
D+  (via drill 0.3)
  Top 0.127: U1.A6 61.85,19.94 61.78,20.01 61.78,20.84 61.88,20.95 U1.B6 62.61,20.95 63.63,20.95 v63.75,20.83 | IC4.3 43.11,26.07 42.04,27.14 42.04,28.96 41.82,29.17 40.05,29.17 38.95,28.07 38.95,27.94 37.53,26.53 36.18,26.53 35.56,25.91 35.56,21.46 v36.83,20.19 | v41.15,20.57 41.78,20.57 41.87,20.48 42.47,20.48 44.31,18.63 47.68,18.63 49.28,20.23 49.28,21.09 52.32,24.13 54.72,24.13 55.12,24.52 55.12,25.57 55.32,25.77 56.94,25.77 57.09,25.62 57.09,23.86 57.09,23.85 | v8.13,27.81 8.13,26.67 v10.16,24.64 | v10.16,15.49 10.16,14.42 10.41,14.16 10.41,8 12.45,5.97 18.54,5.97 19.81,4.7 34.42,4.7 41.91,12.19 51.82,12.19 55.75,16.13 v55.75,17.02 | v57.4,22.99 57.4,23.54 57.09,23.85 | 57.09,23.85 56.39,23.16 D1.3
  Bottom 0.127: v36.83,20.19 40.77,20.19 v41.15,20.57 | v10.16,15.49 v10.16,24.64 | v55.75,17.02 55.75,21.34 v57.4,22.99 59.69,22.99 61.85,20.83 v63.75,20.83 | TP5.1 11.21,40.69 9.91,39.39 9.91,31.88 9.93,31.86 9.93,29.61 v8.13,27.81
D-  (via drill 0.3)
  Top 0.127: U1.B7 63.46,19.44 63.63,19.61 v63.63,20.07 63.63,20.18 63.36,20.44 U1.A7 | v42.67,25.53 43.56,25.53 IC4.4 | 60.17,21.56 59.37,22.35 55.37,22.35 55.12,22.61 55.12,24.13 56.01,25.02 D1.4 | 60.17,21.56 60.31,21.42 60.31,16.66 60.1,16.45 57.53,16.45 56.33,17.65 53.34,17.65 51.94,16.26 51.94,15.75 50.16,13.97 44.39,13.97 43.81,14.54 43.81,16.26 40.51,19.56 40.51,21.08 v38.73,22.86 37.34,22.86 36.96,23.24 36.96,25.02 v36.45,25.53 | v10.54,42.29 11.56,42.29 13.84,40.01 13.84,38.61 14.99,37.47 14.99,32.77 15.49,32.26 16.38,32.26 19.43,29.21 19.43,28.7 21.53,26.6 28.26,26.6 v28.83,26.04 | 60.17,21.56 v60.2,21.59
  Bottom 0.127: v42.67,25.53 41.4,25.53 v38.73,22.86 | v10.54,42.29 11.18,42.93 11.18,43.18 TP6.1 | v28.83,26.04 35.94,26.04 v36.45,25.53 | v63.63,20.07 61.72,20.07 v60.2,21.59
DE1  (via drill 0.3)
  Top 0.127: v34.04,30.48 34.04,28.96 IC13.3
  Bottom 0.127: v34.04,30.48 34.04,30.99 32.87,32.15 32.87,32.93 32.73,33.08 32.73,37.94 35.32,40.53 35.32,41.63 35.23,41.72 35.23,43.42 42.65,50.85 47.17,50.85 JP16.1
DE2  (via drill 0.3)
  Top 0.127: v35.94,39.88 37.78,38.03 37.78,33.46 34.7,30.37 IC13.4
  Bottom 0.127: v35.94,39.88 35.94,41.73 35.74,41.94 35.74,43.21 41.29,48.77 44.54,48.77 45.59,49.82 JP16.3
DE3  (via drill 0.3)
  Top 0.127: v35.34,30.14 35.34,28.88 IC13.5
  Bottom 0.127: v35.34,30.14 33.13,32.35 33.13,33.04 32.98,33.18 32.98,37.81 35.69,40.51 35.69,41.62 35.48,41.83 35.48,43.32 41.95,49.78 43.08,49.78 JP16.5
DTR  (via drill 0.3)
  Top 0.127: R3.2 51.64,26.87 v51.69,26.92 51.69,27.38 52.62,28.31 IC6.4 | v45.72,29.21 45.39,29.21 44.89,28.71 IC4.23 | v48.01,27.69 48.51,27.18 v48.51,26.16
  Bottom 0.127: v48.51,26.16 50.93,26.16 v51.69,26.92 | v45.72,29.21 45.72,28.54 46.57,27.69 v48.01,27.69
FLASH_SCK  (via drill 0.3)
  Top 0.127: v45.15,38.23 45.59,38.23 46.1,38.74 IC9.31 | IC7.6 v42.34,42.95 v42.33,42.96
  Bottom 0.127: v45.15,38.23 45.5,38.58 45.5,39.19 44.96,39.73 44.96,40.33 v42.33,42.96
FLASH_SCS  (via drill 0.3)
  Top 0.127: v44.95,38.97 45.12,39.14 IC9.30 | IC7.1 39.8,34.8 v39.78,34.79
  Bottom 0.127: v39.78,34.79 40.27,34.79 40.84,35.36 41.3,35.36 41.8,34.86 41.8,34.62 42.12,34.3 42.56,34.3 42.88,34.62 42.88,36.61 44.6,38.34 44.6,38.46 44.95,38.8 v44.95,38.97
FLASH_SDI  (via drill 0.3)
  Top 0.127: IC9.33 47.2,37.94 46.98,38.15 46.53,38.15 46.22,37.84 46.22,37.73 v45.97,37.48 | IC7.5 v43.6,42.94
  Bottom 0.127: v43.6,42.94 45.22,41.32 45.22,39.91 45.97,39.16 v45.97,37.48
FLASH_SDO  (via drill 0.3)
  Top 0.127: IC9.32 47.16,38.34 47.09,38.41 46.13,38.41 45.41,37.69 45.34,37.69 v45.15,37.49 | IC7.2 v41.06,34.83 v41.07,34.82
  Bottom 0.127: v41.07,34.82 41.23,34.82 42.01,34.04 42.67,34.04 43.14,34.51 43.14,35.48 v45.15,37.49
FLASH_SHD  (via drill 0.3)
  Top 0.127: v44.33,40.17 44.56,39.94 IC9.28 | IC7.7 41.06,42.9 v41.04,42.92
  Bottom 0.127: v41.04,42.92 41.67,42.29 42.21,42.29 v44.33,40.17
FLASH_SWP  (via drill 0.3)
  Top 0.127: v44.33,39.38 44.49,39.54 IC9.29 | IC7.3 v42.34,34.84
  Bottom 0.127: v42.34,34.84 42.34,36.52 44.33,38.51 v44.33,39.38
FLASH_VDD
  Top 0.127: C21.2 C22.2 41.33,32.46 38.99,34.8 38.99,41.76 39.06,41.82 IC7.8 39.78,41.84 39.78,43.15 40.19,43.56 43.81,43.56 43.96,43.42 43.96,43.38 46.59,40.75 47.83,40.75 IC9.26
GND  (via drill 0.3, 0.35)  (14 unrouted)
  Top 0.127: C51.2 30,44.74 C49.1 28.16,45.61 IC14.18 23.82,45.61 23.72,45.51 23.72,45.11 v23.97,44.86 23.88,44.83 23.5,44.45 IC14.25 | IC14.11 24.22,43.61 v23.97,43.86 23.88,43.94 23.5,44.32 IC14.25 | 49.91,38.86 49.91,37.97 v49.87,37.94 | v50.87,37.94 50.93,37.97 50.93,38.86 IC9.49 | 51.94,38.86 51.94,37.97 v51.87,37.94 | 49.91,38.86 v49.87,38.94 | 49.91,38.86 IC9.49 | v50.87,38.94 50.93,38.99 IC9.49 | 51.94,38.86 v51.87,38.94 | 51.94,38.86 IC9.49 | 50.8,40.01 49.91,40.01 v49.87,39.94 | 50.8,40.01 v50.87,39.94 50.93,40.01 51.82,40.01 v51.87,39.94 | 50.8,40.01 IC9.49 | 61.71,41.28 58.98,38.56 58.07,38.56 C18.1 | 61.71,41.28 62.36,40.64 J1.5 | 61.71,41.28 61.34,41.66 | v57.53,42.67 57.53,42.29 58.04,41.78 C17.1 59.44,41.78 59.98,42.33 60.67,42.33 61.34,41.66 | C19.1 56.97,32.49 56.97,31.41 C26.1 | C26.1 C16.1 C20.1 58.09,32.51 61.14,35.56 J1.2 | C26.1 56.9,31.37 56.39,30.86 52.2,30.86 L1.2 52.04,30.89 51.17,31.76 50.9,31.76 50.07,32.59 L1.4 50.03,32.51 | 66.42,44.58 66.42,41.66 67.44,40.64 J1.4 J1.3 66.55,35.56 63.88,32.89 63.88,31.24 62.48,29.84 62.48,28.83 JP17.6 | 66.42,44.58 66.42,44.83 67.44,45.85 67.44,46.86 JP9.2 | 61.34,41.66 64.26,44.58 66.42,44.58 | C50.2 60.33,2.91 60.07,3.17 52.96,3.17 51.82,2.03 ENC1.C1 | SW1.1_2 66.93,6.48 66.93,11.94 SW1.2_2 66.8,12.06 65.79,12.06 63.97,13.88 62.44,13.88 61.34,14.99 61.34,17.02 61.35,17.02 | C11.1 44.41,20.29 C13.1 | C14.1 47.5,19.68 46.76,19.68 46.14,20.28 C13.1 | 60.85,22.61 58.7,22.61 58.3,23.01 R1.2 R2.2 58.3,25.1 57.4,26 57.42,26.02 | 57.42,26.02 57.4,26.04 54.99,26.04 53.98,25.02 D1.1 53.85,25.02 53.59,25.27 49.28,25.27 46.74,22.73 46.74,20.77 46.24,20.28 C13.1
  Top 0.127: v58.67,26.04 57.44,26.04 57.42,26.02 | R27.2 36.99,43.4 38.73,41.66 38.73,34.62 40.06,33.29 | 40.06,33.29 41.93,31.43 42.49,31.43 C22.1 C21.1 43.74,31.54 44.58,32.38 v44.58,32.51 | 40.06,33.29 37.34,30.57 37.34,28.96 IC13.8 | 40.77,39.24 40.77,38.48 v40.7,38.36 | v41.7,38.36 41.66,38.48 41.66,38.86 IC7.9 | 40.77,39.24 v40.7,39.36 | 40.77,39.24 IC7.9 | v41.7,39.36 41.66,39.24 41.66,38.99 IC7.9 | 42.67,38.48 42.67,39.24 v42.7,39.36 | 39.5,27.69 39.24,27.69 38.86,27.3 38.86,25.78 39.24,25.4 40.39,25.4 R6.2 | C10.1 C12.1 40.37,27.58 40.37,27.61 39.5,27.61 39.5,27.69 | v39.5,27.81 39.5,27.69 | C30.1 47.22,32.46 47.22,31.43 C28.1 46.46,31.39 46.27,31.21 45.87,31.21 43.72,29.06 43.66,29.06 42.69,28.08 42.69,26.9 43.02,26.56 IC4.2 44.94,26.56 45.09,26.42 | v46.13,25.31 46.1,25.4 45.72,25.78 IC4.25 | v46.13,26.31 46.1,26.29 45.72,25.91 IC4.25 | 45.09,26.42 v45.13,26.31 | 45.09,26.42 IC4.25 | 42.67,38.48 IC7.9 | 42.67,38.48 v42.7,38.36 | R22.1 4.32,9.65 4.7,9.65 6.23,11.19 D3.2 6.35,14.1 v8.13,15.88 | IC11.5 10.7,23.64 10.8,23.75 13.5,23.75 R15.2 13.46,23.11 12.57,22.23 R16.1 12.45,22.1 12.06,22.1 10.41,20.45 9.4,20.45 v9.29,20.4 9.27,20.32 8.89,19.94 IC11.9 | v8.29,19.4 8.38,19.43 8.76,19.81 IC11.9 | v8.29,20.4 8.38,20.32 8.76,19.94 IC11.9 | v9.29,19.4 9.27,19.43 8.89,19.81 IC11.9 | C15.2 19.56,37.93 19.75,37.74 21.22,37.74 C33.2 23.91,37.75 v24.64,38.48 26.28,38.48 C37.2 | C37.2 | IC13.13 34.69,35.84 C41.2 31.36,37.79 30.86,37.29 30.2,37.29 29.7,37.79 C37.2 | JP3.1 48.26,58.55 51.44,58.55 JP6.1 51.56,58.55 54.61,58.55 JP8.1 54.74,58.55 57.15,56.13 58.42,56.13 JP4.1 | IC10.13 23.21,34.73 23.21,33.43 25.81,30.83 IC10.8 25.82,28.85 25.82,27.39 v25.68,27.25
  Top 0.127: 2.17,24.77 2.92,24.77 C36.1 | 2.17,24.77 1.4,24.77 C35.1 | 2.17,24.77 2.17,29.21 2.03,29.21 | v22.97,43.86 22.99,43.94 23.37,44.32 IC14.25 | IC14.25 23.37,44.45 22.99,44.83 v22.97,44.86 22.97,45.25 22.61,45.61 IC14.1 21.52,46.54 21.97,46.99 21.97,49.45 22.3,49.78 C48.2 23.19,51.25 23.5,51.56 v25.65,51.56 | 13.59,18.8 13.46,18.67 R19.1 | 12.57,17.78 R12.2 12.92,18.19 12.92,18.32 13.4,18.8 13.59,18.8 | 13.59,18.8 R19.1 | 14.64,15.88 C31.1 | C29.2 37.97,48.01 32.26,48.01 R11.2 31.82,48 31.24,48.59 v31.24,48.95 | C47.2 R36.1 44.32,17.53 43.56,17.53 v41.27,19.81 | C44.2 C45.2 24.1,22.93 23.77,22.61 v23.5,22.61 | C40.1 C39.1 34.22,24.6 34.42,24.41 v34.42,20.32 | R35.1 15.66,47.06 C46.1 12.89,47.06 v12.83,47.12 | v19.09,33.23 18.67,33.65 18.67,33.83 18.91,34.07 18.91,35.33 18.67,35.57 18.67,36.64 17.89,37.42 IC5.18 | 29.34,58.67 29.59,58.93 30.82,58.93 30.93,58.75 IC8.12 | 14.64,15.88 11.43,15.88 10.67,15.11 10.67,10.79 12.57,8.89 J2.GND | 2.03,29.21 JP14.3 | v26.85,19.35 26.67,19.53 26.67,22.99 28.19,24.51 R21.2 28.32,24.64 29.21,24.64 C38.1 29.34,24.64 29.34,25.15 29.89,25.7 30.95,25.7 31.55,26.29 IC12.8 31.55,31.17 30.73,31.98 30.11,31.98 28.79,33.3 28.79,33.75 28.95,33.91 IC12.13 | 29.34,58.67 v29.46,58.55 | IC4.25 45.59,25.78 45.21,25.4 v45.13,25.31 | v10.54,32 9.43,32 9.21,32.22 7.58,32.22 7.36,32 4.18,32 2.03,29.85 2.03,29.21 | JP7.2 25.26,58.56 26.29,57.53 28.2,57.53 29.34,58.67 | R19.1 14.35,18.84 14.64,18.55 14.64,15.88 | v45.59,19.18 45.5,19.27 C13.1
  Top 0.152: U1.B1A12 61.6,23.39 60.85,22.64 60.85,22.61 60.85,17.52 61.35,17.02 61.38,16.99 U1.A1B12
  Top 0.2: v44.53,34.42 44.12,34.42 43.6,34.93 IC7.4 43.6,37.52 42.77,38.36 v42.7,38.36 | C5.2 v16.28,30.59 13.75,33.12 13.75,37.82 13.31,38.26 | 12.2,39.38 11.14,39.38 | 11.14,39.38 IC5.4 | 13.31,38.26 12.2,39.38 | IC5.9 11.19,36.12 | 11.19,36.12 13.31,38.26 | IC5.10 10.54,35.48 11.19,36.12 | IC5.3 10.49,40.02 11.14,39.38 | 12.2,39.38 12.2,39.62 v12.78,40.2
  Bottom 0.127: DSP1.D24 23.68,4.94 | 23.68,4.94 19.48,4.94 DSP1.D30 19.48,11.83 | 23.68,4.94 24.39,4.94 | 24.39,4.94 DSP1.D23 | 24.39,4.94 25.79,4.94 | 25.79,4.94 DSP1.D21 | 25.79,4.94 27.18,4.94 | 27.18,4.94 DSP1.D19 | 27.18,4.94 27.89,4.94 | 27.89,4.94 29.29,4.94 | 29.29,4.94 DSP1.D16 | 29.29,4.94 29.98,4.94 | 29.98,4.94 DSP1.D15 | 29.98,4.94 30.68,4.94 | DSP1.D14 30.68,4.94 | 30.68,4.94 33.48,4.94 | DSP1.D10 33.48,4.94 | 33.48,4.94 34.19,4.94 | 34.19,4.94 DSP1.D9 | 34.19,4.94 34.88,4.94 | 34.88,4.94 DSP1.D8 | 34.88,4.94 35.59,4.94 | 35.59,4.94 DSP1.D7 | 35.59,4.94 36.28,4.94 | DSP1.D6 36.28,4.94 | 36.28,4.94 39.09,4.94 | 39.09,4.94 DSP1.D2 | 39.09,4.94 39.78,4.94 DSP1.D1 | v57.53,42.67 54.86,42.67 52.2,40.01 51.94,40.01 v51.87,39.94 | J1.2 62.99,35.56 65.41,33.15 65.91,33.15 67.44,34.67 67.44,35.56 J1.3 | ENC1.C1 51.82,2.03 52.7,2.03 56.13,5.46 65.91,5.46 66.8,6.35 SW1.1_2 | v58.67,26.04 61.34,28.7 62.36,28.7 JP17.6 | v39.5,27.81 42.04,27.81 43.81,29.59 45.13,29.59 | v8.13,15.88 8.13,19.18 8.26,19.3 v8.29,19.4 | 38.23,16.3 C4.2 35.43,19.05 34.42,20.07 v34.42,20.32 | 38.23,16.26 38.21,16.28 | v12.83,47.12 12.78,47.12 | v41.27,19.81 41.51,19.58 41.53,19.56 | v12.78,40.2 12.78,39.77 11.3,38.3 11.3,38.23 TP4.1 11.18,38.1 10.29,37.21 10.29,32.64 10.54,32.38 v10.54,32 | v19.09,33.23 18.63,33.23 16.38,30.99 16.38,30.61 v16.28,30.59 | v31.24,48.95 31.24,51.94 31.21,51.96 | JP2.2 2.03,52.07 2.03,53.09 7.37,58.42 JP15.3 | 26.31,52.21 v25.65,51.56 | v24.64,38.48 24.64,43.18 24,43.81 v23.97,43.86 | v45.59,19.18 40.64,14.22 39.5,14.22 37.83,15.9 | U1.P$6 67.63,12.75 SW1.2_2 65.24,13.66 63.92,13.66 63.33,14.25 U1.P$3 | C1.2 12.11,25.94 8.31,25.94 7.98,25.61 7.98,20.71 v8.29,20.4
  Bottom 0.127: v29.46,58.55 29.88,58.96 47.8,58.96 JP3.1 | DSP1.D18 27.89,4.95 27.89,4.94 | v25.68,27.25 25.02,26.59 22.92,26.59 22.33,26
  Bottom 0.15: CON1.14 31.34,52.09 31.21,51.96 26.56,51.96 26.31,52.21 25.19,53.33 JP5.2 25.19,56.78 | 25.19,56.78 25.19,58.53 JP7.2 | 15.56,56.75 25.16,56.75 25.19,56.78
  Bottom 0.2: IC1.1 31.73,14.29 C9.2 C7.2 36.22,14.29 37.83,15.9 38.21,16.28 38.23,16.3 41.51,19.58 41.66,19.73 41.66,20.18 42.87,21.39 43.29,21.39 43.63,21.73 43.63,21.91 45.13,23.41 v45.13,25.31 | v45.13,26.31 45.13,29.59 45.13,31.13 44.96,31.3 44.96,32.13 v44.58,32.51 44.58,34.37 v44.53,34.42 | C8.2 20.73,25.43 21.3,26 22.33,26 23.45,24.88 23.45,22.65 v23.49,22.61 v23.5,22.61 23.97,22.61 26.85,19.73 v26.85,19.35 27.07,19.35 27.45,18.97 27.45,16.05 | C6.2 18.26,28.61 v16.28,30.59 | JP15.3 JP11.3 JP12.3 15.56,56.75 15.56,53.09 12.78,50.31 12.78,47.12 12.78,45.84 12.14,45.2 12.14,44.68 12.77,44.05 12.77,43.58 12.63,43.43 12.63,41.31 12.78,41.16 v12.78,40.2
  Bottom 0.254: C1.2 C2.2 C3.2 18.24,25.42 C6.2 19.88,25.44 C8.2 | J2.GND 15.55,11.83 19.48,11.83 28.19,11.83 | IC1.1 31.49,13.43 29.89,11.83 28.19,11.83 | 28.19,11.83 28.19,15.31 27.45,16.05 25.06,16.05 | 25.06,16.05 24.49,15.48 IC2.1 | IC3.1 17.49,16.1 17.92,16.53 24.58,16.53 25.06,16.05
  other vias: 62.73,37.64
  pour Top: 0,60.5 69.55,60.5 69.55,3.85 69.55,0 66,0 0,0
  pour Bottom: 0,60.5 69.55,60.5 69.55,1.7 69.55,0 66.25,0 0,0
GYRO3V3  (via drill 0.3)
  Top 0.127: 26.42,43.11 28.17,43.11 28.28,43.22 C49.2 29.86,43.22 29.98,43.1 C51.1 31.24,43.1 31.46,43.33 FL3.2 | 26.42,43.11 IC14.13 | v20.57,43.43 20.57,42.73 21.65,41.66 22.6,41.66 22.73,41.79 22.73,42.29 IC14.8 | 26.42,43.11 v26.42,43.69
  Bottom 0.127: v20.57,43.43 22.61,45.47 24.64,45.47 v26.42,43.69
LED_L_BLUE  (via drill 0.3)
  Top 0.127: v19.43,30.35 17.27,32.51 15.62,32.51 15.24,32.89 15.24,37.59 14.1,38.73 14.1,41.91 13.72,42.29 12.83,42.29 11.76,43.36 11.07,43.36 10.28,44.15 R34.2 | v28.32,30.1 28.32,28.96 IC12.3
  Bottom 0.127: v19.43,30.35 20.49,30.35 20.58,30.26 20.67,30.26 20.87,30.06 28.29,30.06 v28.32,30.1
LED_L_GREEN  (via drill 0.3)
  Top 0.127: v6.94,33.51 12.47,33.51 v15.24,30.73 | IC12.2 27.66,28.88 27.66,31 v27.62,31.04 | v7.62,42.04 7.62,42.65 7.06,43.21 R30.2